# EAGLE design DBPIC18DIPv1.7 (EAGLE 6.5.0)
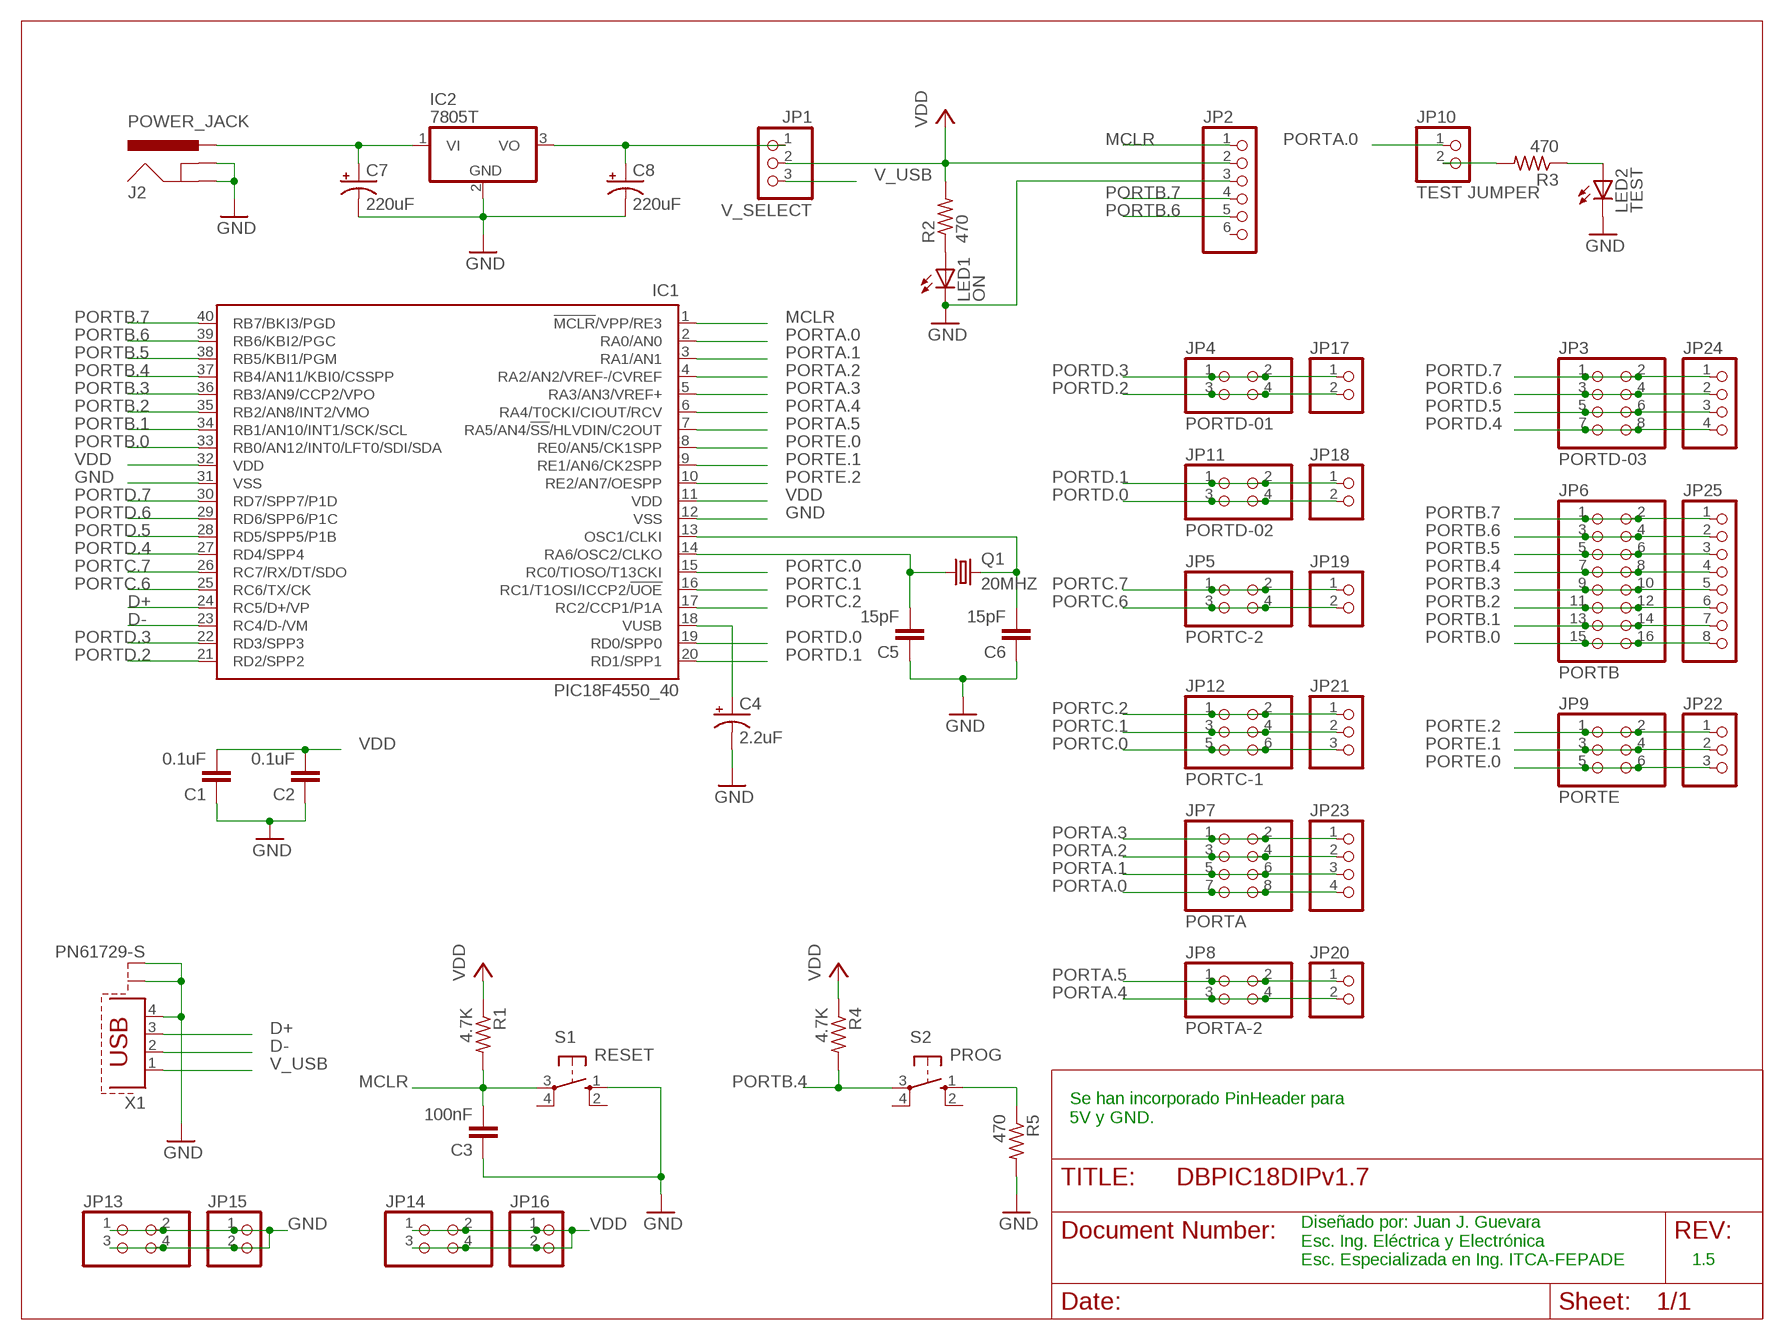
[diagram p0: schematic, sheet 1]

## Parts
C1  0.1uF  C2.5/2  [C2.5-2]
C2  0.1uF  C2.5/2  [C2.5-2]
C3  100nF  C2.5/2  [C2.5-2]
C4  2.2uF  CPOL-USE1.8-4  [E1,8-4]
C5  15pF  C2.5/2  [C2.5-2]
C6  15pF  C2.5/2  [C2.5-2]
C7  220uF  CPOL-USE2-5  [E2-5]
C8  220uF  CPOL-USE1.8-4  [E1,8-4]
IC1  PIC18F4550_40  [DIL40]
IC2  7805T  [TO220H]
J2  POWER_JACK  [POWER_JACK_PTH]
JP1  V_SELECT  PINHD-1X3  [1X03]
JP2  PINHD-1X6  [1X06]
JP3  PORTD-03  PINHD-2X4  [2X04]
JP4  PORTD-01  PINHD-2X2  [2X02]
JP5  PORTC-2  PINHD-2X2  [2X02]
JP6  PORTB  PINHD-2X8  [2X08]
JP7  PORTA  PINHD-2X4  [2X04]
JP8  PORTA-2  PINHD-2X2  [2X02]
JP9  PORTE  PINHD-2X3  [2X03]
JP10  TEST JUMPER  PINHD-1X2  [1X02]
JP11  PORTD-02  PINHD-2X2  [2X02]
JP12  PORTC-1  PINHD-2X3  [2X03]
JP13  PINHD-2X2  [2X02]
JP14  PINHD-2X2  [2X02]
JP15  PINHD-1X2  [1X02]
JP16  PINHD-1X2  [1X02]
JP17  PINHD-1X2  [1X02]
JP18  PINHD-1X2  [1X02]
JP19  PINHD-1X2  [1X02]
JP20  PINHD-1X2  [1X02]
JP21  PINHD-1X3  [1X03]
JP22  PINHD-1X3  [1X03]
JP23  PINHD-1X4  [1X04]
JP24  PINHD-1X4  [1X04]
JP25  PINHD-1X8  [1X08]
LED1  ON  LED3MM  [LED3MM]
LED2  TEST  LED3MM  [LED3MM]
Q1  20MHZ  CRYSTALHC49S  [HC49/S]
R1  4.7K  R-US_0207/12  [0207/12]
R2  470  R-US_0207/12  [0207/12]
R3  470  R-US_0207/12  [0207/12]
R4  4.7K  R-US_0207/12  [0207/12]
R5  470  R-US_0207/12  [0207/12]
S1  RESET  10-XX  [B3F-10XX]
S2  PROG  10-XX  [B3F-10XX]
X1  PN61729-S  [PN61729-S]

## Nets
D+: IC1.24(RC5/D+/VP) X1.3
D-: IC1.23(RC4/D-/VM) X1.2
GND: C1.1 C2.1 C3.1 C4.- C5.1 C6.1 C7.- C8.- IC1.12(VSS) IC1.31(VSS) IC2.2(GND) J2.GND J2.GNDBREAK JP2.3 JP13.1 JP13.2 JP13.3 JP13.4 JP15.1 JP15.2 LED1.K(C) LED2.K(C) R5.2 S1.1(S) X1.4 X1.S1 X1.S2
MCLR: C3.2 IC1.1(!MCLR!/VPP/RE3) JP2.1 R1.2 S1.3(P)
N$1: LED2.A R3.1
N$2: C6.2 IC1.13(OSC1/CLKI) Q1.2
N$3: C5.2 IC1.14(RA6/OSC2/CLKO) Q1.1
N$4: C4.+ IC1.18(VUSB)
N$5: C8.+ IC2.3(VO) JP1.1
N$6: LED1.A R2.1
N$7: JP10.2 R3.2
N$8: R5.1 S2.1(S)
N$9: C7.+ IC2.1(VI) J2.PWR
PORTA.0: IC1.2(RA0/AN0) JP7.7 JP7.8 JP10.1 JP23.4
PORTA.1: IC1.3(RA1/AN1) JP7.5 JP7.6 JP23.3
PORTA.2: IC1.4(RA2/AN2/VREF-/CVREF) JP7.3 JP7.4 JP23.2
PORTA.3: IC1.5(RA3/AN3/VREF+) JP7.1 JP7.2 JP23.1
PORTA.4: IC1.6(RA4/T0CKI/CIOUT/RCV) JP8.3 JP8.4 JP20.2
PORTA.5: IC1.7(RA5/AN4/!SS!/HLVDIN/C2OUT) JP8.1 JP8.2 JP20.1
PORTB.0: IC1.33(RB0/AN12/INT0/LFT0/SDI/SDA) JP6.15 JP6.16 JP25.8
PORTB.1: IC1.34(RB1/AN10/INT1/SCK/SCL) JP6.13 JP6.14 JP25.7
PORTB.2: IC1.35(RB2/AN8/INT2/VMO) JP6.11 JP6.12 JP25.6
PORTB.3: IC1.36(RB3/AN9/CCP2/VPO) JP6.9 JP6.10 JP25.5
PORTB.4: IC1.37(RB4/AN11/KBI0/CSSPP) JP6.7 JP6.8 JP25.4 R4.2 S2.3(P)
PORTB.5: IC1.38(RB5/KBI1/PGM) JP6.5 JP6.6 JP25.3
PORTB.6: IC1.39(RB6/KBI2/PGC) JP2.5 JP6.3 JP6.4 JP25.2
PORTB.7: IC1.40(RB7/BKI3/PGD) JP2.4 JP6.1 JP6.2 JP25.1
PORTC.0: IC1.15(RC0/TIOSO/T13CKI) JP12.5 JP12.6 JP21.3
PORTC.1: IC1.16(RC1/T1OSI/ICCP2/!UOE) JP12.3 JP12.4 JP21.2
PORTC.2: IC1.17(RC2/CCP1/P1A) JP12.1 JP12.2 JP21.1
PORTC.6: IC1.25(RC6/TX/CK) JP5.3 JP5.4 JP19.2
PORTC.7: IC1.26(RC7/RX/DT/SDO) JP5.1 JP5.2 JP19.1
PORTD.0: IC1.19(RD0/SPP0) JP11.3 JP11.4 JP18.2
PORTD.1: IC1.20(RD1/SPP1) JP11.1 JP11.2 JP18.1
PORTD.2: IC1.21(RD2/SPP2) JP4.3 JP4.4 JP17.2
PORTD.3: IC1.22(RD3/SPP3) JP4.1 JP4.2 JP17.1
PORTD.4: IC1.27(RD4/SPP4) JP3.7 JP3.8 JP24.4
PORTD.5: IC1.28(RD5/SPP5/P1B) JP3.5 JP3.6 JP24.3
PORTD.6: IC1.29(RD6/SPP6/P1C) JP3.3 JP3.4 JP24.2
PORTD.7: IC1.30(RD7/SPP7/P1D) JP3.1 JP3.2 JP24.1
PORTE.0: IC1.8(RE0/AN5/CK1SPP) JP9.5 JP9.6 JP22.3
PORTE.1: IC1.9(RE1/AN6/CK2SPP) JP9.3 JP9.4 JP22.2
PORTE.2: IC1.10(RE2/AN7/OESPP) JP9.1 JP9.2 JP22.1
V_USB: JP1.3 X1.1
VDD: C1.2 C2.2 IC1.11(VDD) IC1.32(VDD) JP1.2 JP2.2 JP14.1 JP14.2 JP14.3 JP14.4 JP16.1 JP16.2 R1.1 R2.2 R4.1
Unconnected: JP2.6 S1.2(S1) S1.4(P1) S2.2(S1) S2.4(P1)

## Notes on the sheet
- Se han incorporado PinHeader para
  5V y GND.
- Diseñado por: Juan J. Guevara
  Esc. Ing. Eléctrica y Electrónica
  Esc. Especializada en Ing. ITCA-FEPADE
- 1.5

## Library data of the parts
C1-C3 C5 C6 = capacitor-wima:C: CAPACITOR naming: grid - package width
C4 C7 C8 = rcl:CPOL-US: POLARIZED CAPACITOR, American symbol
IC1 = microchip:PIC18F4*_40: USB Microcontrollers with nanoWatt Technology High-Performance, Enhanced Flash, 28/40/44-Pin, Source: http://ww1.microchip.com/downloads/en/devicedoc/39632c.pdf; MF: MICROCHIP; MPN: PIC18F4550-I/P; OC_FARNELL: 9321357; OC_NEWARK: 74K8623
IC2 = linear:78*: Positive VOLTAGE REGULATOR Source: http://cache.national.com/ds/LM/LM78L05.pdf http://www.fairchildsemi.com/ds/LM/LM7805.pdf
J2 = SparkFun-Connectors:POWER_JACK: Power Jack Connector This is the standard 5.5mm barrel jack for power. The PTH is the most common, proven, reliable, footprint. The Slot footprint only works if the mill layer is transmitted to the PCB fab house so be warned. Here are the connectors we sell at SparkFun: DC Barrel Power Jack/Connector <https://www.sparkfun.com/products/119> (PRT-00119) DC Barrel Power Jack/Connector (SMD) <https://www.sparkfun.com/products/12748> (PRT-12748) DC Barrel Jack Adapter - Breadboard Compatible <https://www.sparkfun.com/products/10811> (PRT-10811) It is used on this SparkFun product (and many, many others): SparkFun RedBoard - Programmed with Arduino <https://www.sparkfun.com/products/12757> (DEV-12757) Also, if you need a mating power supply or connector, please check these out: Wall Adapter Power Supply - 9VDC 650mA <https://www.sparkfun.com/products/298> (TOL-00298) DC Barrel Jack Adapter - Male <https://www.sparkfun.com/products/10287> (PRT-10287); PROD_ID: CONN-08197
JP1 JP21 JP22 = pinhead:PINHD-1X3: PIN HEADER
JP2 = pinhead:PINHD-1X6: PIN HEADER
JP3 JP7 = pinhead:PINHD-2X4: PIN HEADER
JP4 JP5 JP8 JP11 JP13 JP14 = pinhead:PINHD-2X2: PIN HEADER
JP6 = pinhead:PINHD-2X8: PIN HEADER
JP9 JP12 = pinhead:PINHD-2X3: PIN HEADER
JP10 JP15-JP20 = pinhead:PINHD-1X2: PIN HEADER
JP23 JP24 = pinhead:PINHD-1X4: PIN HEADER
JP25 = pinhead:PINHD-1X8: PIN HEADER
LED1 LED2 = led:LED: LED OSRAM: - CHIPLED LG R971, LG N971, LY N971, LG Q971, LY Q971, LO R971, LY R971 LH N974, LH R974 LS Q976, LO Q976, LY Q976 LO Q996 - Hyper CHIPLED LW Q18S LB Q993, LB Q99A, LB R99A - SideLED LS A670, LO A670, LY A670, LG A670, LP A670 LB A673, LV A673, LT A673, LW A673 LH A674 LY A675 LS A676, LA A676, LO A676, LY A676, LW A676 LS A679, LY A679, LG A679 - Hyper Micro SIDELED® LS Y876, LA Y876, LO Y876, LY Y876 LT Y87S - SmartLED LW L88C, LW L88S LB L89C, LB L89S, LG L890 LS L89K, LO L89K, LY L89K LS L896, LA L896, LO L896, LY L896 - TOPLED LS T670, LO T670, LY T670, LG T670, LP T670 LSG T670, LSP T670, LSY T670, LOP T670, LYG T670 LG T671, LOG T671, LSG T671 LB T673, LV T673, LT T673, LW T673 LH T674 LS T676, LA T676, LO T676, LY T676, LB T676, LH T676, LSB T676, LW T676 LB T67C, LV T67C, LT T67C, LS T67K, LO T67K, LY T67K, LW E67C LS E67B, LA E67B, LO E67B, LY E67B, LB E67C, LV E67C, LT E67C LW T67C LS T679, LY T679, LG T679 LS T770, LO T770, LY T770, LG T770, LP T770 LB T773, LV T773, LT T773, LW T773 LH T774 LS E675, LA E675, LY E675, LS T675 LS T776, LA T776, LO T776, LY T776, LB T776 LHGB T686 LT T68C, LB T68C - Hyper Mini TOPLED® LB M676 - Mini TOPLED Santana® LG M470 LS M47K, LO M47K, LY M47K Source: http://www.osram.convergy.de LUXEON: - LUMILED® LXK2-PW12-R00, LXK2-PW12-S00, LXK2-PW14-U00, LXK2-PW14-V00 LXK2-PM12-R00, LXK2-PM12-S00, LXK2-PM14-U00 LXK2-PE12-Q00, LXK2-PE12-R00, LXK2-PE12-S00, LXK2-PE14-T00, LXK2-PE14-U00 LXK2-PB12-K00, LXK2-PB12-L00, LXK2-PB12-M00, LXK2-PB14-N00, LXK2-PB14-P00, LXK2-PB14-Q00 LXK2-PR12-L00, LXK2-PR12-M00, LXK2-PR14-Q00, LXK2-PR14-R00 LXK2-PD12-Q00, LXK2-PD12-R00, LXK2-PD12-S00 LXK2-PH12-R00, LXK2-PH12-S00 LXK2-PL12-P00, LXK2-PL12-Q00, LXK2-PL12-R00 Source: www.luxeon.com KINGBRIGHT: KA-3528ASYC Source: www.kingbright.com
Q1 = crystal:CRYSTAL: CRYSTAL; OC_FARNELL: 1667008; OC_NEWARK: unknown
R1-R5 = rcl:R-US_: RESISTOR, American symbol
S1 S2 = switch-omron:10-XX: OMRON SWITCH; MPN: B3F-1000; OC_FARNELL: 176432; OC_NEWARK: 36M3542
X1 = con-berg:PN61729-S: BERG USB connector; OC_FARNELL: unknown; OC_NEWARK: unknown

## Board
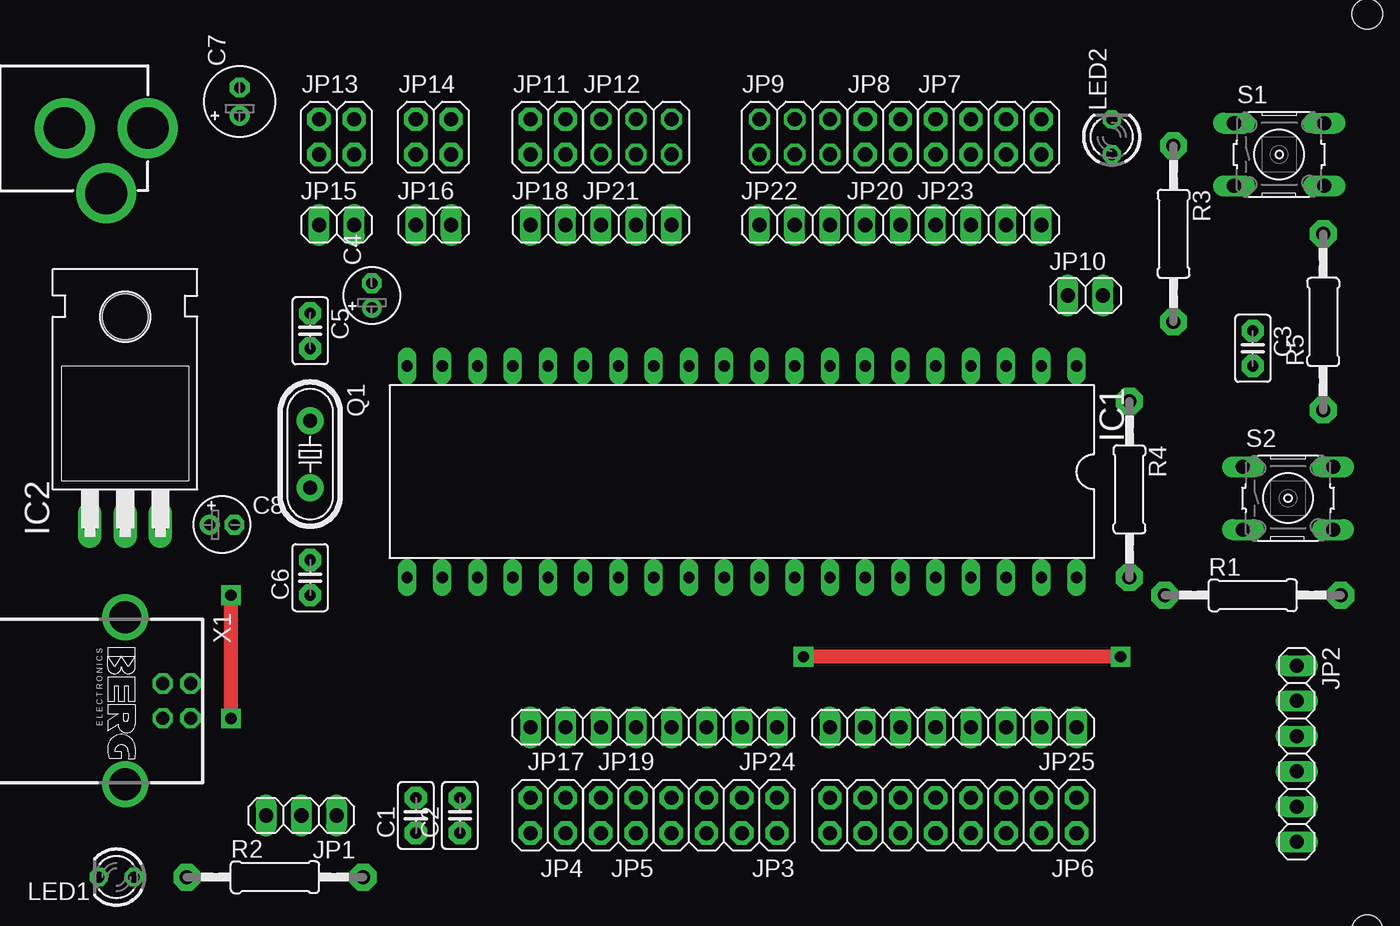
[diagram p1: board, top side]
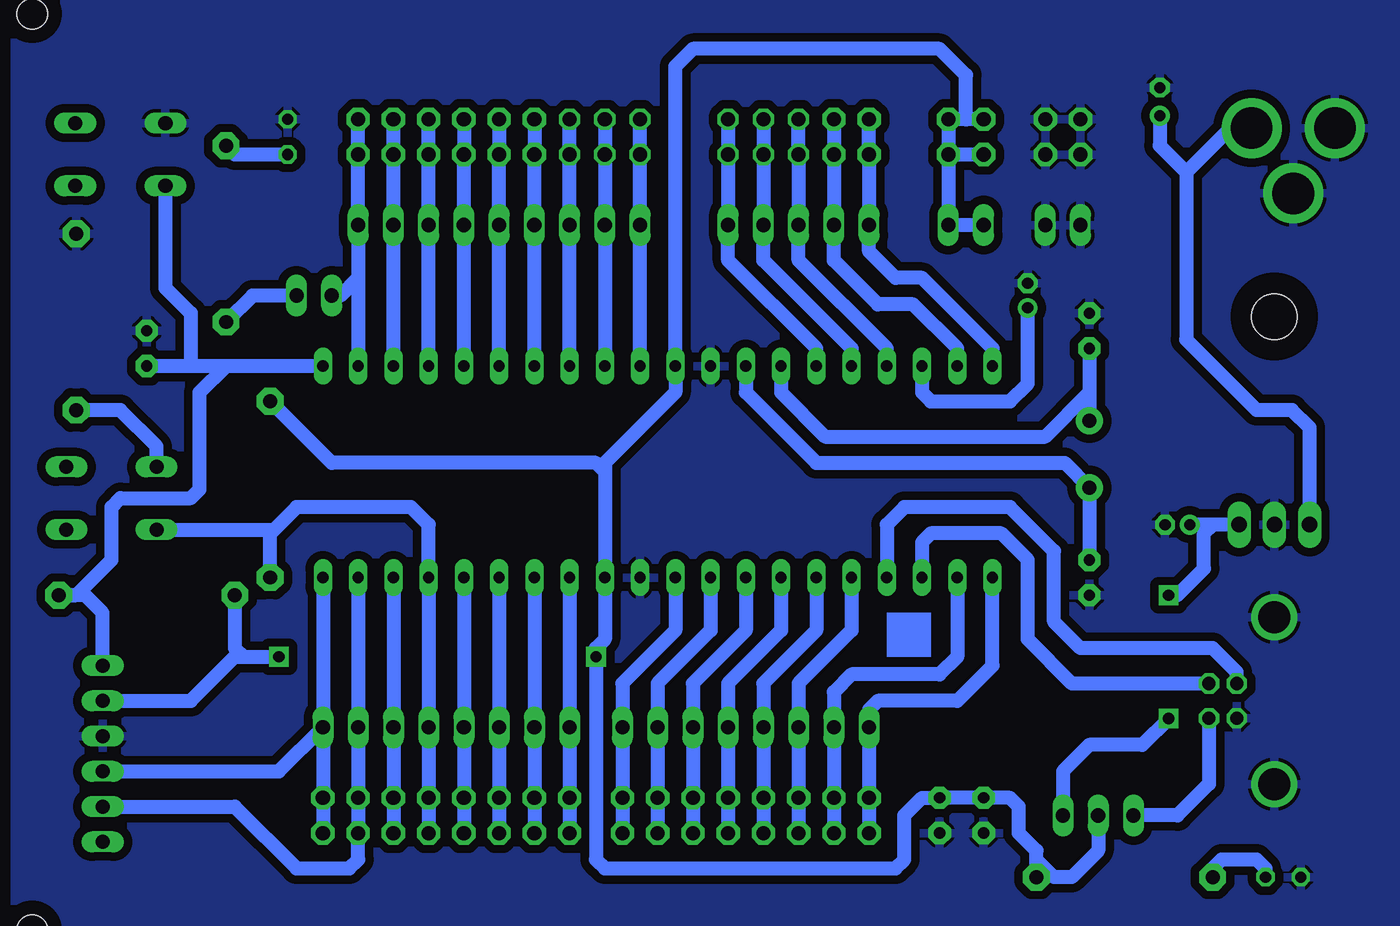
[diagram p2: board, bottom side, seen from below]

No outline drawn. Coordinates in mm, seen from the top.
Copper layers (1*16): Top 0.035mm / dielectric 1.5mm / Bottom 0.035mm
Design rules "default": minimum track width 10mil, minimum drill 24mil, track to track 8mil, track to pad 8mil, pad to pad 8mil, via to via 8mil, smd to smd 8mil, copper to edge 40mil, drill to drill 8mil, minimum pad ring 10mil, minimum via ring 8mil, stop-mask expansion 4mil, vias tented up to drill 0mil, thermal gap 10mil
Holes 2.2 mm at 0.64,67.31 0.64,0.64 101.6,0.64 101.6,66.67

### Footprints (pad centres in the part's own frame; a part is rotated, then mirrored left to right if it is on the bottom)
C2.5-2 = drill 0.813 pad 1.6 octagon: 1 -1.27,0; 2 1.27,0
E1,8-4 = drill 0.8 pad 1.422: + -0.889,0 | drill 0.8 pad 1.422 octagon: - 0.889,0
E2-5 = drill 0.8 pad 1.422: + -1.016,0 | drill 0.8 pad 1.422 octagon: - 1.016,0
DIL40 = drill 0.813 long: 1 -24.13,-7.62; 2 -21.59,-7.62; 3 -19.05,-7.62; 4 -16.51,-7.62; 5 -13.97,-7.62; 6 -11.43,-7.62; 7 -8.89,-7.62; 8 -6.35,-7.62; 9 -3.81,-7.62; 10 -1.27,-7.62; 11 1.27,-7.62; 12 3.81,-7.62; 13 6.35,-7.62; 14 8.89,-7.62; 15 11.43,-7.62; 16 13.97,-7.62; 17 16.51,-7.62; 18 19.05,-7.62; 19 21.59,-7.62; 20 24.13,-7.62; 21 24.13,7.62; 22 21.59,7.62; 23 19.05,7.62; 24 16.51,7.62; 25 13.97,7.62; 26 11.43,7.62; 27 8.89,7.62; 28 6.35,7.62; 29 3.81,7.62; 30 1.27,7.62; 31 -1.27,7.62; 32 -3.81,7.62; 33 -6.35,7.62; 34 -8.89,7.62; 35 -11.43,7.62; 36 -13.97,7.62; 37 -16.51,7.62; 38 -19.05,7.62; 39 -21.59,7.62; 40 -24.13,7.62
TO220H = drill 1.118 long: 1 -2.54,-10.16; 2 0,-10.16; 3 2.54,-10.16 | hole 3.302: 0,4.826
POWER_JACK_PTH = drill 2.997 pad 4.318: GND 0,7.7; GNDBREAK 4.7,10.7; PWR 0,13.7
1X03 = drill 1.016 long: 1 -2.54,0; 2 0,0; 3 2.54,0
1X06 = drill 1.016 long: 1 -6.35,0; 2 -3.81,0; 3 -1.27,0; 4 1.27,0; 5 3.81,0; 6 6.35,0
2X04 = drill 1.016 pad 1.676 octagon: 1 -3.81,-1.27; 2 -3.81,1.27; 3 -1.27,-1.27; 4 -1.27,1.27; 5 1.27,-1.27; 6 1.27,1.27; 7 3.81,-1.27; 8 3.81,1.27
2X02 = drill 1.016 pad 1.676 octagon: 1 -1.27,-1.27; 2 -1.27,1.27; 3 1.27,-1.27; 4 1.27,1.27
2X08 = drill 1.016 pad 1.676 octagon: 1 -8.89,-1.27; 2 -8.89,1.27; 3 -6.35,-1.27; 4 -6.35,1.27; 5 -3.81,-1.27; 6 -3.81,1.27; 7 -1.27,-1.27; 8 -1.27,1.27; 9 1.27,-1.27; 10 1.27,1.27; 11 3.81,-1.27; 12 3.81,1.27; 13 6.35,-1.27; 14 6.35,1.27; 15 8.89,-1.27; 16 8.89,1.27
2X03 = drill 1.016 octagon: 1 -2.54,-1.27; 2 -2.54,1.27; 3 0,-1.27; 4 0,1.27; 5 2.54,-1.27; 6 2.54,1.27
1X02 = drill 1.016 long: 1 -1.27,0; 2 1.27,0
1X04 = drill 1.016 long: 1 -3.81,0; 2 -1.27,0; 3 1.27,0; 4 3.81,0
1X08 = drill 1.016 long: 1 -8.89,0; 2 -6.35,0; 3 -3.81,0; 4 -1.27,0; 5 1.27,0; 6 3.81,0; 7 6.35,0; 8 8.89,0
LED3MM = drill 0.813 octagon: A -1.27,0; K 1.27,0
HC49/S = drill 1 pad 1.93: 1 -2.413,0; 2 2.413,0
0207/12 = drill 1 pad 1.93 octagon: 1 -6.35,0; 2 6.35,0
B3F-10XX = drill 1.016 long: 1 -3.251,2.261; 2 3.251,2.261; 3 -3.251,-2.261; 4 3.251,-2.261
PN61729-S = drill 0.95 octagon: 1 1.25,4.71; 2 -1.25,4.71; 3 -1.25,2.71; 4 1.25,2.71 | drill 2.3 pad 2.9: S1 -6.02,0; S2 6.02,0

### Placement (x,y rotation side)
C1  33.02,8.89 90 top
C2  36.2,8.89 90 top
C3  93.34,42.55 270 top
C4  29.84,46.35 90 top
C5  25.4,43.81 270 top
C6  25.4,26.04 90 top
C7  20.32,60.33 90 top
C8  19.05,29.84 0 top
IC1  56.52,33.66 180 top
IC2  12.06,40.01 0 top
J2  0,58.42 270 top
JP1  24.77,8.89 180 top
JP2  96.52,13.34 270 top
JP3  55.24,8.89 180 top
JP4  42.55,8.89 180 top
JP5  47.62,8.89 180 top
JP6  71.75,8.89 180 top
JP7  74.3,57.78 0 top
JP8  66.67,57.78 0 top
JP9  60.33,57.78 0 top
JP10  81.28,46.35 0 top
JP11  42.55,57.78 0 top
JP12  48.9,57.78 0 top
JP13  27.3,57.78 0 top
JP14  34.29,57.78 0 top
JP15  27.3,51.44 0 top
JP16  34.29,51.44 0 top
JP17  42.55,15.24 180 top
JP18  42.55,51.44 0 top
JP19  47.62,15.24 180 top
JP20  66.67,51.44 0 top
JP21  48.9,51.44 0 top
JP22  60.33,51.44 0 top
JP23  74.3,51.44 0 top
JP24  55.24,15.24 180 top
JP25  71.75,15.24 180 top
LED1  11.43,4.45 180 top
LED2  83.19,57.78 90 top
Q1  25.4,34.92 270 top
R1  93.34,24.77 0 top
R2  22.86,4.45 0 top
R3  87.63,50.8 270 top
R4  84.45,32.38 270 top
R5  98.42,44.45 90 top
S1  95.25,56.52 0 top
S2  95.89,31.75 0 top
X1  12.06,17.14 270 top

### Tracks (layer width: path | path; a pad name or v marks a point on that pad's centre or on a via)
D+
  Bottom 1.016: IC1.24 40.01,29.84 38.73,31.11 31.11,31.11 27.94,27.94 27.94,22.86 26.04,20.95 23.5,20.95 22.86,20.95 16.51,20.95 14.78,19.22 X1.3
D-
  Bottom 1.016: IC1.23 37.47,28.57 36.83,29.21 31.75,29.21 29.84,27.3 29.84,21.59 26.65,18.39 X1.2
GND
  pour Bottom (isolate 0.61): 0,68.58 102.87,68.58 102.87,0 0,0
MCLR
  Bottom 1.016: IC1.1 87.63,41.27 | 87.63,41.27 90.17,41.27 | 90.17,41.27 C3.2 | S1.3 92,46.91 90.17,45.09 90.17,41.27 | JP2.1 96.52,23.5 97.79,24.77 R1.2 98.42,24.77 95.89,27.3 95.89,31.11 95.25,31.75 90.17,31.75 89.53,32.38 89.53,39.37 87.63,41.27
N$1
  Bottom 1.016: LED2.A 87,56.52 R3.1
N$2
  Bottom 1.016: IC1.13 50.16,39.37 45.09,34.29 27.18,34.29 Q1.2 C6.2
N$3
  Bottom 1.016: C5.2 25.4,39.37 | 25.4,39.37 Q1.1 | IC1.14 47.62,39.37 44.45,36.2 28.57,36.2 25.4,39.37
N$4
  Bottom 1.016: IC1.18 37.47,39.37 36.83,38.73 31.11,38.73 29.84,40.01 C4.+
N$5  (via drill 0.8 pad 1.42)
  Top 1.016: v19.68,24.77 v19.68,15.88
  Bottom 1.016: v19.68,15.88 21.59,13.97 25.4,13.97 27.3,12.06 JP1.1 | IC2.3 16.51,29.84 | 16.51,29.84 C8.+ | v19.68,24.77 19.05,24.77 17.14,26.67 17.14,29.21 16.51,29.84
N$6
  Bottom 1.016: LED1.A 12.7,5.08 13.34,5.71 15.88,5.71 16.51,5.08 R2.1
N$7
  Bottom 1.016: JP10.2 85.72,46.35 R3.2
N$8
  Bottom 1.016: S2.1 92.63,35.48 95.25,38.1 R5.1
N$9
  Bottom 1.016: J2.PWR 15.24,58.42 18.41,55.24 | 18.41,55.24 18.41,43.18 13.34,38.1 10.79,38.1 9.53,36.83 IC2.1 | C7.+ 20.32,57.15 18.41,55.24
PORTA.0
  Bottom 1.016: JP7.8 JP7.7 JP23.4 78.11,47.62 | 78.11,47.62 IC1.2 | JP10.1 79.38,46.35 78.11,47.62
PORTA.1
  Bottom 1.016: IC1.3 JP23.3 JP7.5 JP7.6
PORTA.2
  Bottom 1.016: IC1.4 JP23.2 JP7.3 JP7.4
PORTA.3
  Bottom 1.016: IC1.5 JP23.1 JP7.1 JP7.2
PORTA.4
  Bottom 1.016: IC1.6 JP20.2 JP8.3 JP8.4
PORTA.5
  Bottom 1.016: JP8.2 JP8.1 JP20.1 IC1.7
PORTB.0
  Bottom 1.016: IC1.33 JP25.8 JP6.15 JP6.16
PORTB.1
  Bottom 1.016: IC1.34 JP25.7 JP6.13 JP6.14
PORTB.2
  Bottom 1.016: IC1.35 JP25.6 JP6.11 JP6.12
PORTB.3
  Bottom 1.016: IC1.36 JP25.5 JP6.9 JP6.10
PORTB.4
  Bottom 1.016: JP6.8 JP6.7 JP25.4 IC1.37 73.03,29.84 74.3,31.11 82.55,31.11 84.18,29.49 | R4.2 84.45,29.21 84.18,29.49 | S2.3 84.18,29.49
PORTB.5
  Bottom 1.016: IC1.38 JP25.3 JP6.5 JP6.6
PORTB.6
  Bottom 1.016: IC1.39 JP25.2 JP6.3 JP6.4 78.11,5.71 78.74,5.08 82.55,5.08 87,9.53 JP2.5
PORTB.7
  Bottom 1.016: IC1.40 JP25.1 | JP25.1 JP6.1 JP6.2 | JP2.4 83.82,12.06 JP25.1
PORTC.0
  Bottom 1.016: JP12.6 JP12.5 JP21.3 51.44,48.9 45.09,42.55 IC1.15
PORTC.1
  Bottom 1.016: JP12.4 JP12.3 JP21.2 48.9,48.9 42.55,42.55 IC1.16
PORTC.2
  Bottom 1.016: JP12.2 JP12.1 JP21.1 46.35,48.9 40.01,42.55 IC1.17
PORTC.6
  Bottom 1.016: JP5.4 JP5.3 JP19.2 46.35,18.41 42.55,22.23 IC1.25
PORTC.7
  Bottom 1.016: JP5.2 JP5.1 JP19.1 48.9,18.41 45.09,22.23 IC1.26
PORTD.0
  Bottom 1.016: JP11.4 JP11.3 JP18.2 43.81,48.9 40.64,45.72 38.1,45.72 34.92,42.55 IC1.19
PORTD.1
  Bottom 1.016: JP11.2 JP11.1 JP18.1 41.27,49.53 39.37,47.62 37.47,47.62 32.38,42.55 IC1.20
PORTD.2
  Bottom 1.016: IC1.21 32.38,19.68 34.92,17.14 40.64,17.14 41.27,16.51 JP17.2 JP4.3 JP4.4
PORTD.3
  Bottom 1.016: JP4.2 JP4.1 JP17.1 43.81,17.78 42.55,19.05 36.2,19.05 34.92,20.32 IC1.22
PORTD.4
  Bottom 1.016: JP3.8 JP3.7 JP24.4 51.44,18.41 47.62,22.23 IC1.27
PORTD.5
  Bottom 1.016: JP3.6 JP3.5 JP24.3 53.98,18.41 50.16,22.23 IC1.28
PORTD.6
  Bottom 1.016: JP3.4 JP3.3 JP24.2 56.52,18.41 52.7,22.23 IC1.29
PORTD.7
  Bottom 1.016: JP3.2 JP3.1 JP24.1 59.05,18.41 55.24,22.23 IC1.30
PORTE.0
  Bottom 1.016: IC1.8 JP22.3 JP9.5 JP9.6
PORTE.1
  Bottom 1.016: JP9.4 JP9.3 JP22.2 IC1.9
PORTE.2
  Bottom 1.016: IC1.10 JP22.1 JP9.1 JP9.2
V_USB
  Bottom 1.016: X1.1 16.77,11.16 19.05,8.89 JP1.3
VDD  (via drill 0.8 pad 1.42)
  Top 1.016: v83.82,20.32 v60.96,20.32
  Bottom 1.016: 60.33,33.66 60.33,34.29 55.24,39.37 IC1.11 55.24,62.87 53.98,64.14 36.2,64.14 34.29,62.23 34.29,59.05 | 60.33,33.66 IC1.32 60.33,21.59 60.96,20.95 v60.96,20.32 60.96,5.71 60.33,5.08 39.37,5.08 38.73,5.71 38.73,8.89 37.47,10.16 C2.2 C1.2 31.11,10.16 30.48,9.53 30.48,7.62 29.21,6.35 29.21,5.71 | 60.33,33.66 60.96,34.29 80.01,34.29 R4.1 | JP16.1 JP16.2 JP14.3 | JP14.1 JP14.3 | JP14.2 34.29,59.05 | 34.29,59.05 JP14.4 JP14.3 | JP2.2 90.17,17.14 87,20.32 86.36,20.32 | 86.36,20.32 v83.82,20.32 | R1.1 87,20.95 86.36,20.32 | R2.2 29.21,5.71 | JP1.2 24.77,6.35 26.67,4.45 27.94,4.45 29.21,5.71
(copper drawn outside any net)
  shapes: Bottom area x1

### Text on the board
Document: DC-IN / 6-18V | GND | +5V | D1 / D0 / C2 / C1 / C0 | E2 / E1 / E0 / A5 / A4 / A3 / A2 / A1 / A0 | RESET | TEST | J-TEST | PROG | + | ICSP | VUSB-EXT / VDD SOURCE | ON | D2 / D3 / C6 / C7 / D4 / D5 / D6 / D7 / / B0 / B1 / B2 / B3 / B4 / B5 / B6 / B7